# EasyEDA schematic SCH_d_02_e_04.json
TITLE: Sheet_1; REV: 1.0; Date: 2025-02-08; Sheet: 1/1; Drawn By: artem.v.ulyanov; Company: Your Company
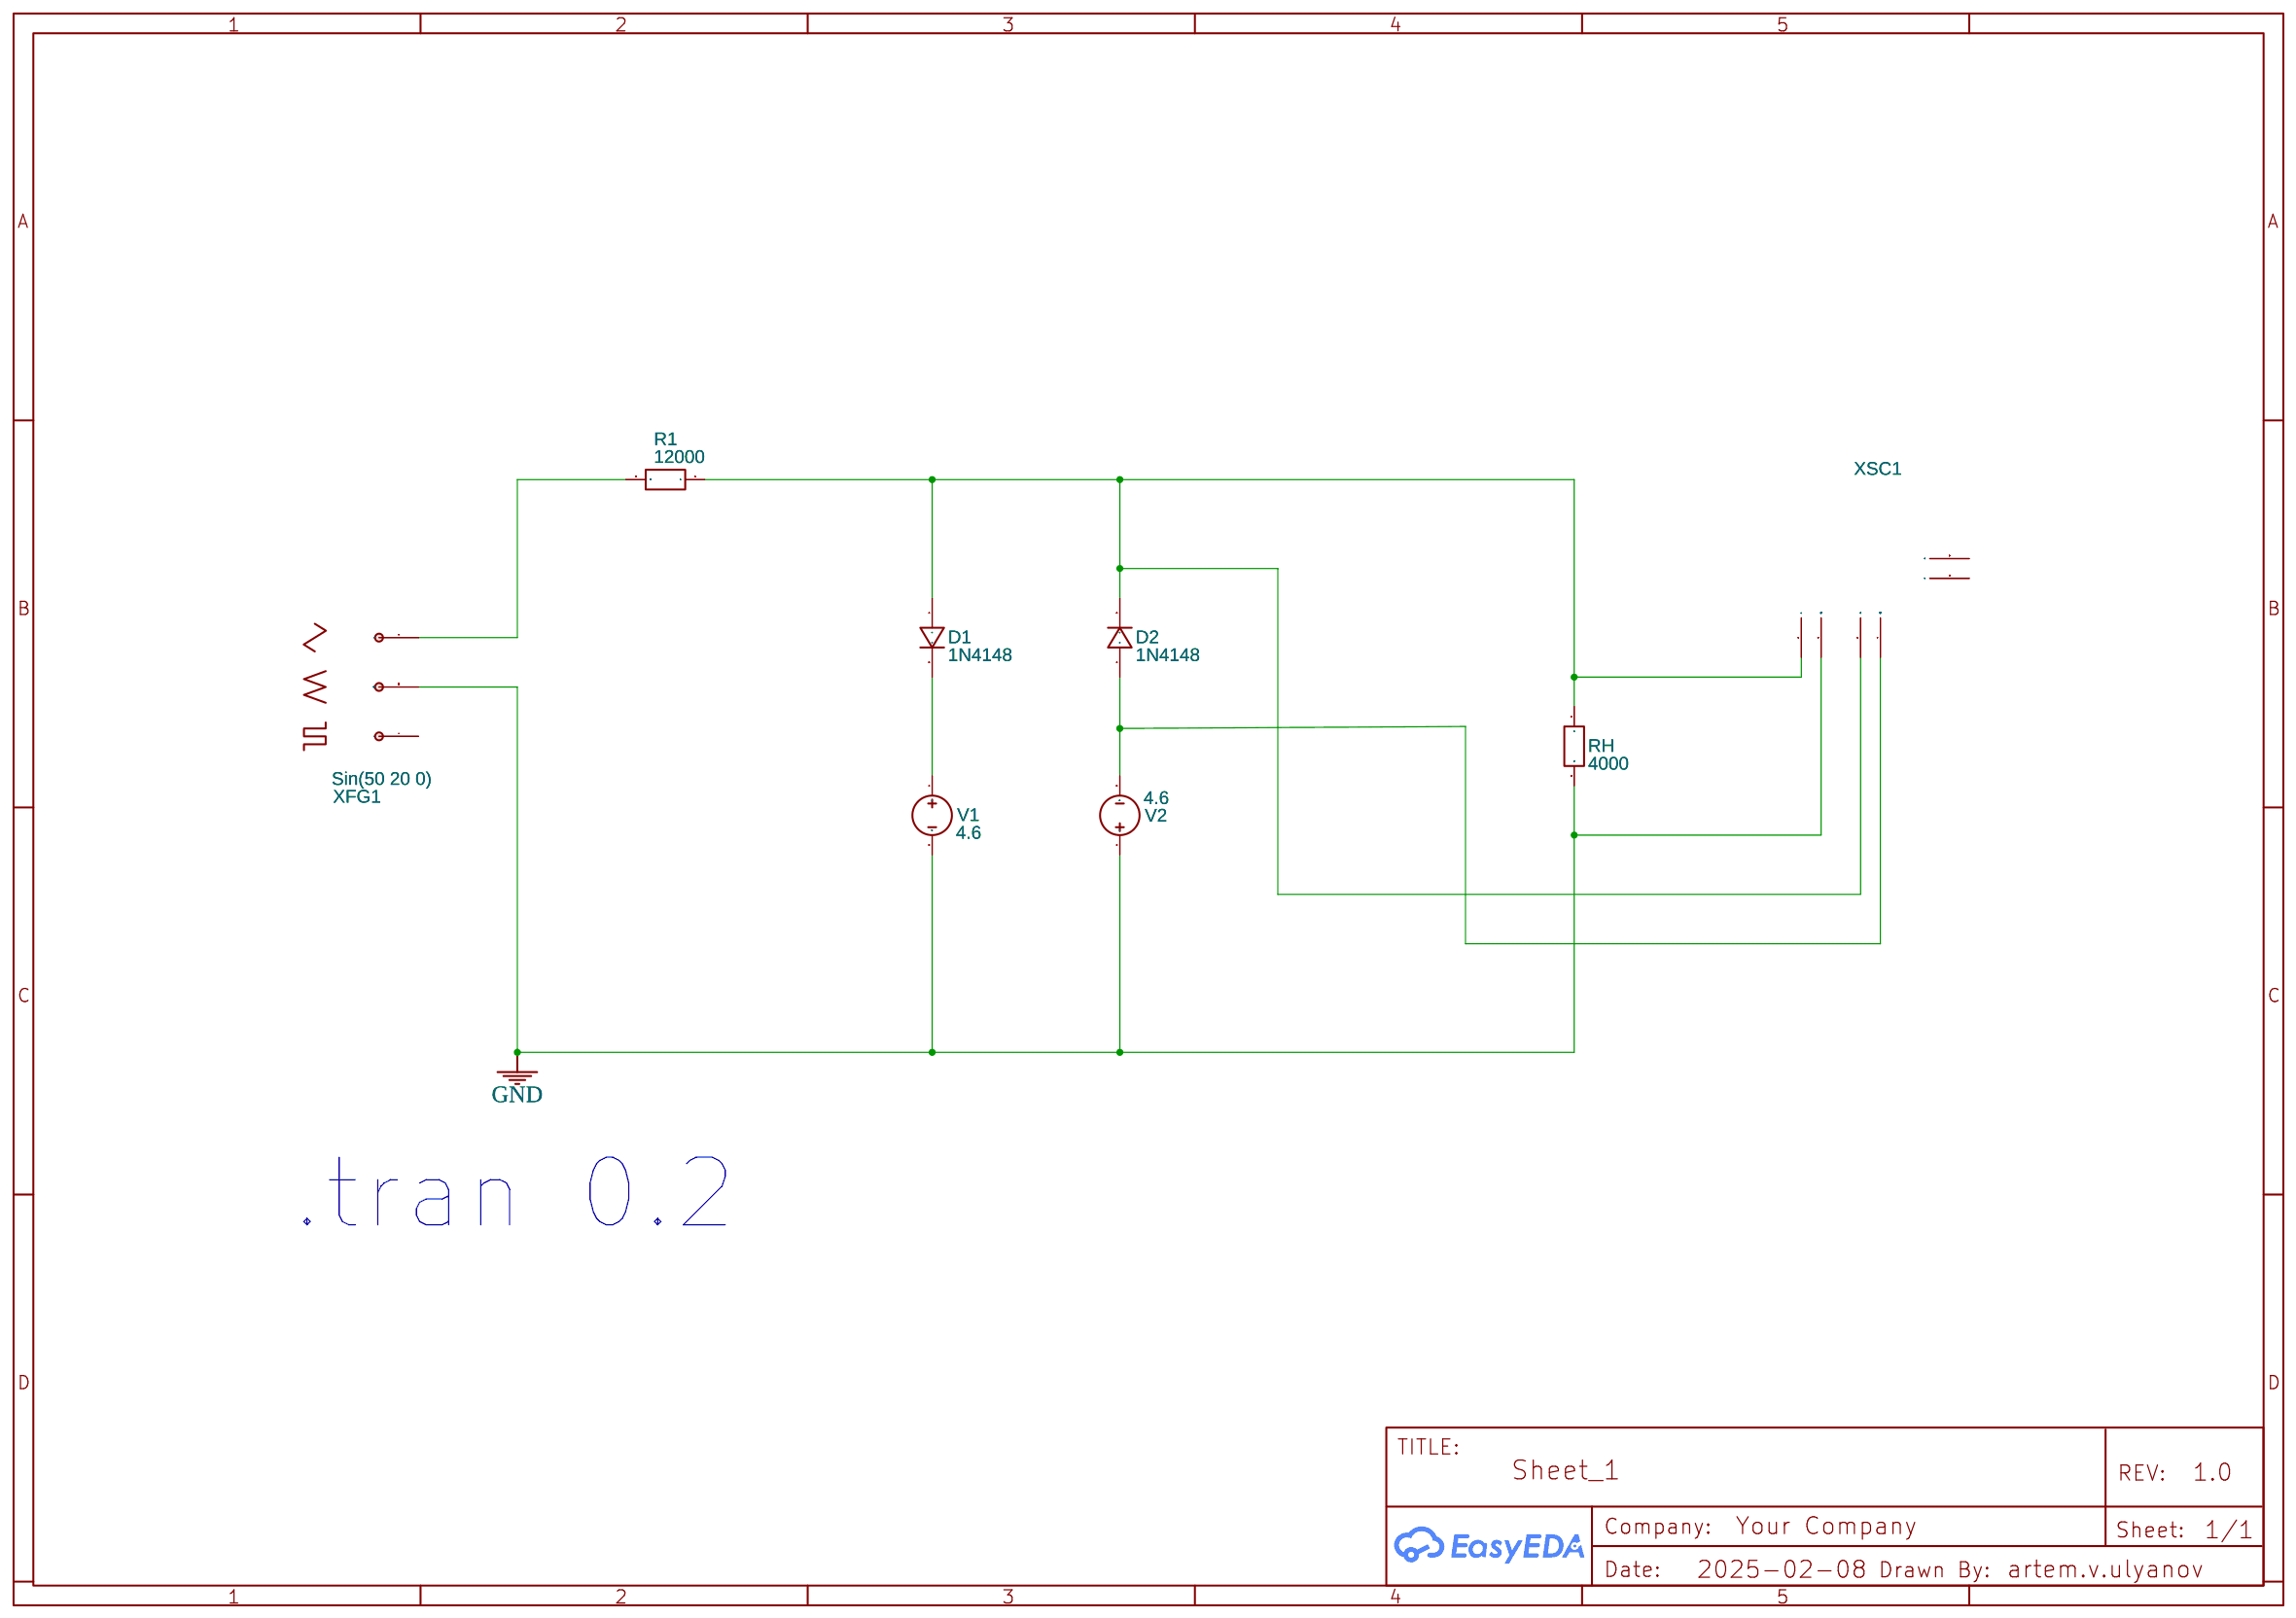
[diagram p0: schematic sheet]

## Parts
D1  1N4148  [DO-35]
D2  1N4148  [DO-35]
R1  12000  [R0603]
RH  4000  [R0603]
V1  4.6  [HDR1X2]
V2  4.6  [HDR1X2]
XFG1  Sin(50 20 0)
XSC1  Oscilloscope

## Library data of the parts
D1 D2 = 1N4148: Contributor: EasyEDA
R1 RH = R_0603_EU: Contributor: LCEDA_Lib
V1 V2 = VDC: Contributor: EasyEDA; sim: true
XFG1 = FUNCTIONGENERATOR: Supplier: LCSC; Waveforms: Sine Wave; Frequency: 50; Duty cycle: 50; Amplitude: 20; Offset: 0; Rise/Fall Time: 10; NameDisplay: 1; Contributor: EasyEDA; sim: true
XSC1 = OSCILLOSCOPE: Contributor: EasyEDA; NameDisplay: 0; sim: true

## Nets
GND: RH.2 V1.2 V2.1 XFG1.COM XSC1.2(GND1)
Net-(D1-1): D1.1(A) D2.2(K) R1.1 RH.1 XSC1.1(A) XSC1.3(B)
Net-(D1-2): D1.2(K) V1.1
Net-(D2-1): D2.1(A) V2.2 XSC1.4(GND2)
Net-(R1-2): R1.2 XFG1.+

Not connected (* = marked no-connect by the designer): XFG1 -; XSC1 5(T+) 6(T-)

## Notes on the sheet
- .tran 0.2
